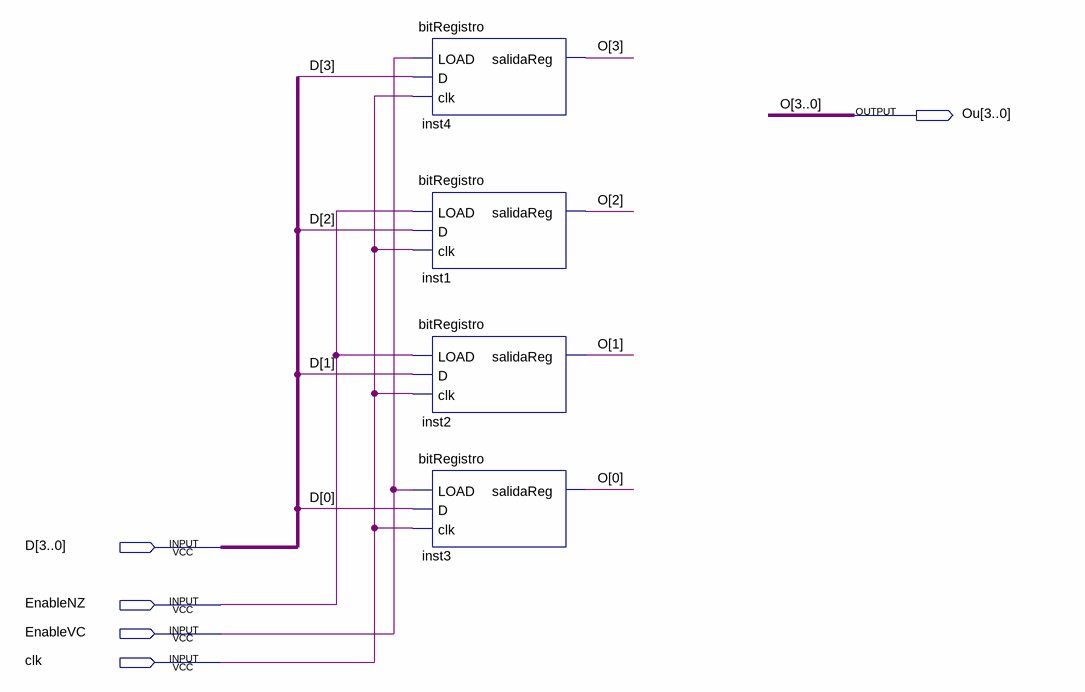
[diagram p0: schematic sheet]
// Quartus schematic RegistroFlags.bdf as structural Verilog: 4 symbols, 5 pins
module RegistroFlags (
  input  [3:0] D,
  input  EnableNZ,
  input  EnableVC,
  input  clk,
  output [3:0] Ou
);

  bitRegistro inst4 (.LOAD(EnableVC), .D(D[3]), .clk(clk), .salidaReg(Ou[3]));
  bitRegistro inst1 (.LOAD(EnableNZ), .D(D[2]), .clk(clk), .salidaReg(Ou[2]));
  bitRegistro inst2 (.LOAD(EnableNZ), .D(D[1]), .clk(clk), .salidaReg(Ou[1]));
  bitRegistro inst3 (.LOAD(EnableVC), .D(D[0]), .clk(clk), .salidaReg(Ou[0]));

  // Other names for the same wires on the sheet: O[3:0] = Ou
endmodule
